# EAGLE design DroneCode_probe-v22 (EAGLE 7.2.0)
CHECK: SAM K; CHECK_DATE: 1/2015; DOC_TITLE_1: MAGIA NEGRA PROBE V2.0; ENGR: JEFF W; ENG_DATE: 1/2015; MFG: JUAN V; MFG_DATE: 1/2015; QA: ALLAN G; QA_DATE: 1/2015; REV: X1; YEAR: 2015
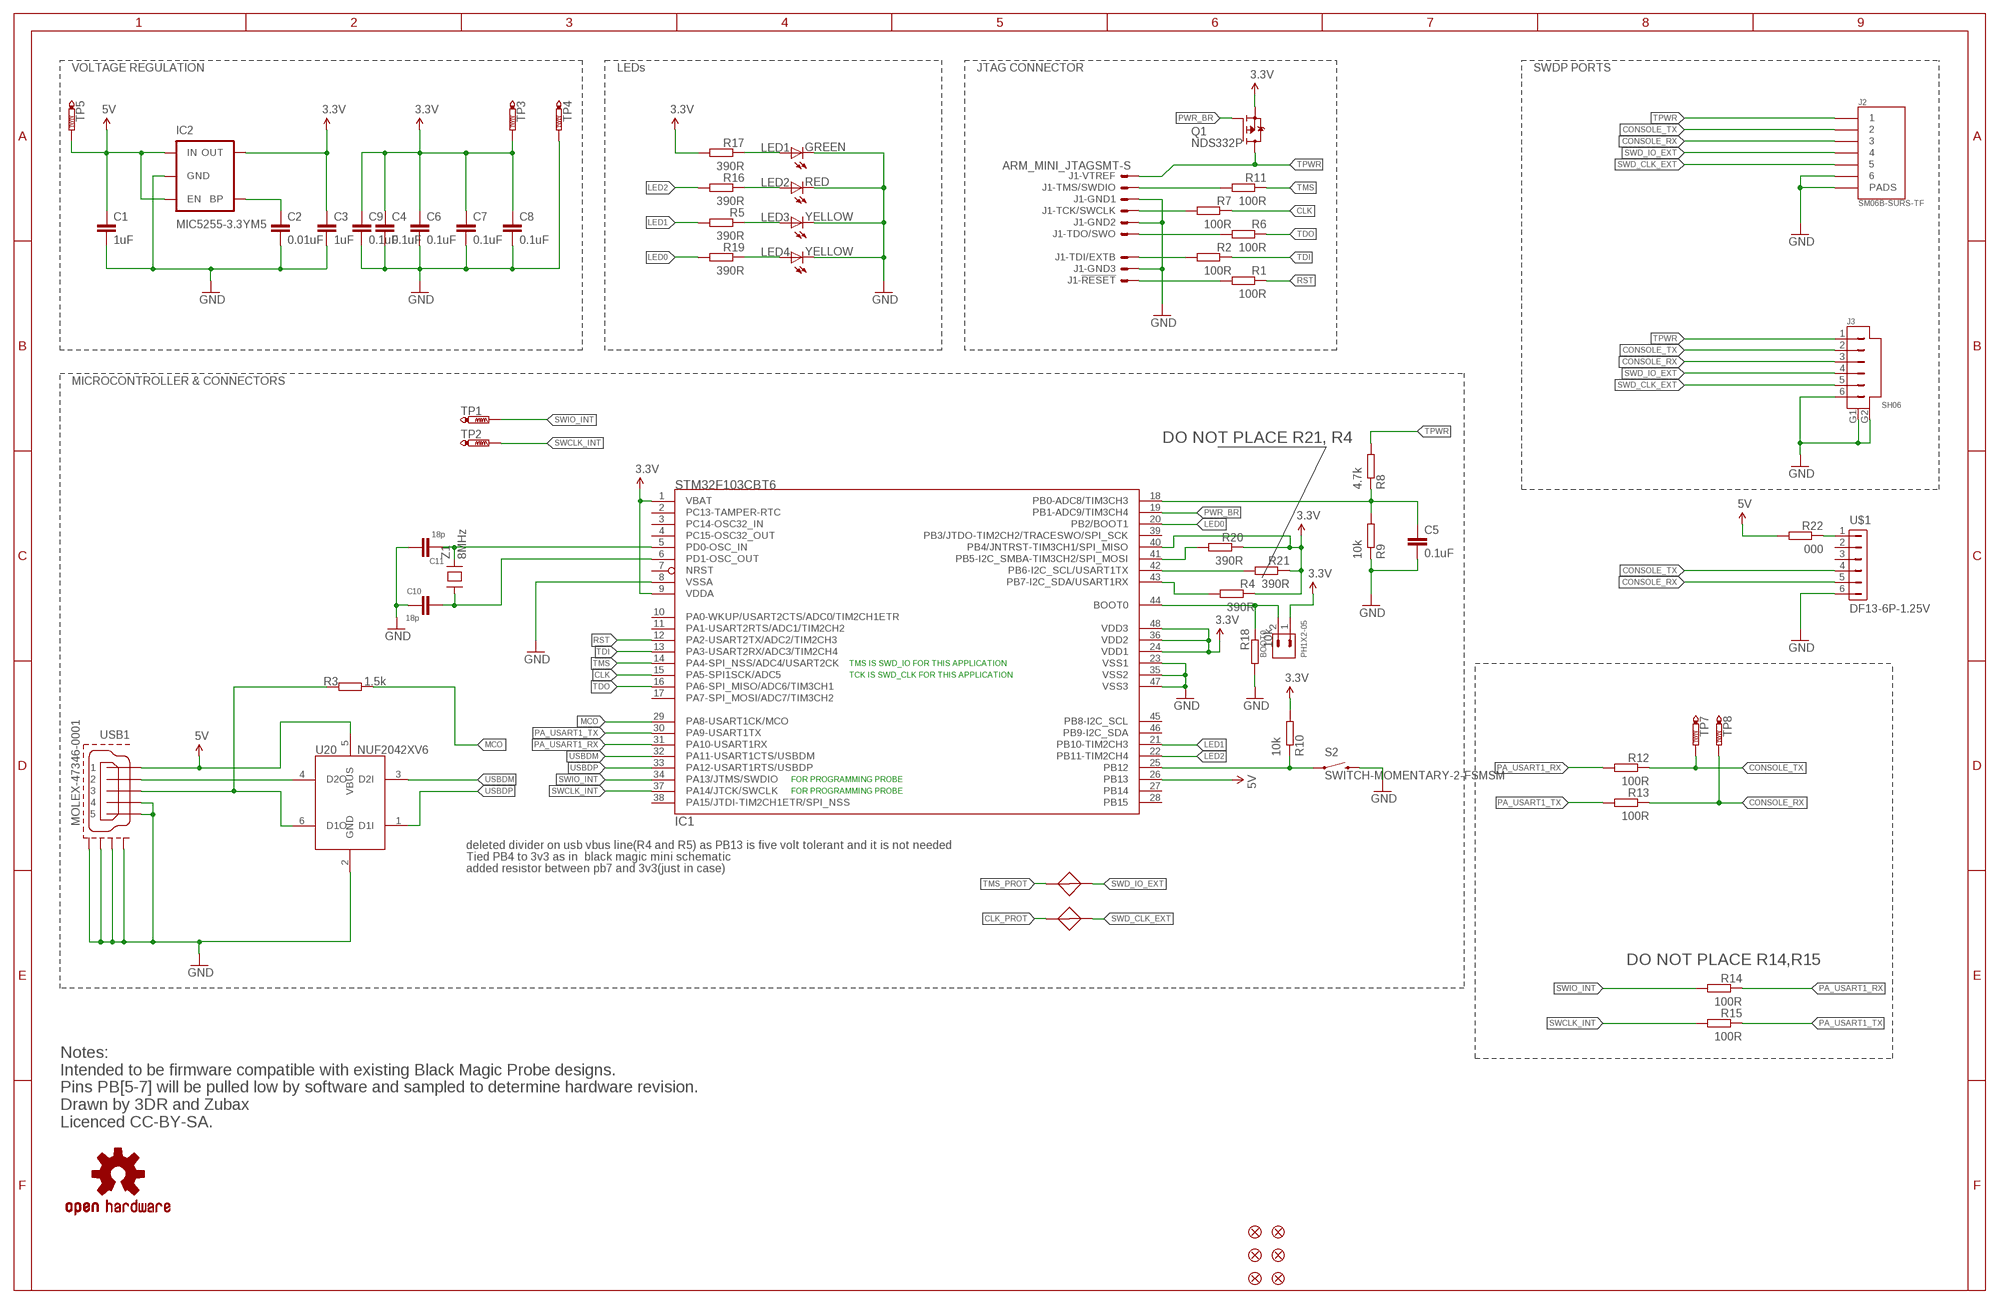
[diagram p0: schematic, sheet 1]

## Parts
BOOT0  PH1X2-05  [PH005-1-2]
C1  1uF  CAPACITOR-0603  [0603-CAP]
C2  0.01uF  CAPACITOR-0402  [0402-CAP]
C3  1uF  CAPACITOR-0603  [0603-CAP]
C4  0.1uF  CAPACITOR-0402  [0402-CAP]
C5  0.1uF  CAPACITOR-0402  [0402-CAP]
C6  0.1uF  CAPACITOR-0402  [0402-CAP]
C7  0.1uF  CAPACITOR-0402  [0402-CAP]
C8  0.1uF  CAPACITOR-0402  [0402-CAP]
C9  0.1uF  CAPACITOR-0402  [0402-CAP]
C10  18p  C0402  [0402]
C11  18p  C0402  [0402]
IC1  STM32F103CBT6  STM32F102CBT6  [LQFP48]
IC2  MIC5255-3.3YM5  V_REG_LDOSMD  [SOT23-5]
J1  ARM_MINI_JTAGSMT-S  [200215-00010T1LF]
J2  SM06B-SURS-TF  [SM02B-SURS-TF]
J3  SH06  [SH06B]
J4  JUNCTION  [JUNCTION]
J5  JUNCTION  [JUNCTION]
JP1  FIDUCIAL1X2  [FIDUCIAL-1X2]
JP2  FIDUCIAL1X2  [FIDUCIAL-1X2]
JP3  FIDUCIAL1X2  [FIDUCIAL-1X2]
JP4  FIDUCIAL1X2  [FIDUCIAL-1X2]
JP5  FIDUCIAL1X2  [FIDUCIAL-1X2]
JP6  FIDUCIAL1X2  [FIDUCIAL-1X2]
LED1  GREEN  LED-0603  [0603-LED]
LED2  RED  LED-0603  [0603-LED]
LED3  YELLOW  LED-0603  [0603-LED]
LED4  YELLOW  LED-0603  [0603-LED]
Q1  NDS332P  [SOT23B-3]
R1  100R  RESISTOR-0402  [0402-RES]
R2  100R  RESISTOR-0402  [0402-RES]
R3  1.5k  RESISTOR-0402  [0402-RES]
R4  390R  RESISTOR-0402  [0402-RES]
R5  390R  RESISTOR-0402  [0402-RES]
R6  100R  RESISTOR-0402  [0402-RES]
R7  100R  RESISTOR-0402  [0402-RES]
R8  4.7k  RESISTOR-0402  [0402-RES]
R9  10k  RESISTOR-0402  [0402-RES]
R10  10k  RESISTOR-0402  [0402-RES]
R11  100R  RESISTOR-0402  [0402-RES]
R12  100R  RESISTOR-0402  [0402-RES]
R13  100R  RESISTOR-0402  [0402-RES]
R14  100R  RESISTOR-0402  [0402-RES]
R15  100R  RESISTOR-0402  [0402-RES]
R16  390R  RESISTOR-0402  [0402-RES]
R17  390R  RESISTOR-0402  [0402-RES]
R18  10k  RESISTOR-0402  [0402-RES]
R19  390R  RESISTOR-0402  [0402-RES]
R20  390R  RESISTOR-0402  [0402-RES]
R21  390R  RESISTOR-0402  [0402-RES]
R22  000  RESISTOR-0402  [0402-RES]
S2  SWITCH-MOMENTARY-2-FSMSM  [FSMSM]
TP1  PTR1B1,27  [B1,27]
TP2  PTR1B1,27  [B1,27]
TP3  PTR1B1,27  [B1,27]
TP4  PTR1B1,27  [B1,27]
TP5  PTR1B1,27  [B1,27]
TP7  PTR1B1,27  [B1,27]
TP8  PTR1B1,27  [B1,27]
U20  NUF2042XV6  [SOT563-6]
U$1  DF13-6P-1.25V  [DF13C-6P-1.25V]
U$5  OSHW-LOGOL  [OSHW-LOGO-L]
USB1  MOLEX-47346-0001  [MOLEX-47346-0001]
Z1  8MHz  CRYSTAL-NX3225GD  [NX3225GD]

## Nets
3.3V: BOOT0.1 C3.P$1 C4.P$1 C6.P$1 C7.P$1 C8.P$1 C9.P$1 IC1.1(VBAT) IC1.9(VDDA) IC1.24(VDD1) IC1.36(VDD2) IC1.40(PB4/JNTRST-TIM3CH1/SPI_MISO) IC1.48(VDD3) IC2.5(OUT) Q1.S R4.P$1 R10.P$2 R17.P$2 R20.P$1 R21.P$1 TP3.TP
5V: C1.P$1 IC1.26(PB13) IC2.1(IN) IC2.3(EN) R22.P$2 TP5.TP U20.5(VBUS) USB1.VBUS
CLK: IC1.15(PA5-SPI1SCK/ADC5) R7.P$1
CLK_PROT: J1.4 J5.P$1 R7.P$2
CONSOLE_RX: J2.3 J3.3 R13.P$1 TP8.TP U$1.5
CONSOLE_TX: J2.2 J3.2 R12.P$1 TP7.TP U$1.4
GND: C1.P$2 C2.P$2 C3.P$2 C4.P$2 C5.P$2 C6.P$2 C7.P$2 C8.P$2 C9.P$2 C10.2 C11.1 IC1.8(VSSA) IC1.23(VSS1) IC1.35(VSS2) IC1.47(VSS3) IC2.2(GND) J1.3 J1.5 J1.9 J2.6 J2.PAD-L(PADS) J2.PAD-R(PADS) J3.6 J3.G1 J3.G2 LED1.C LED2.C LED3.C LED4.C R9.P$1 R18.P$2 S2.P$2 TP4.TP U20.2(GND) U$1.6 USB1.GND USB1.GND1 USB1.GND2 USB1.GND3 USB1.GND4 USB1.ID
LED0: IC1.20(PB2/BOOT1) R19.P$2
LED1: IC1.21(PB10-TIM2CH3) R5.P$2
LED2: IC1.22(PB11-TIM2CH4) R16.P$2
MCO: IC1.29(PA8-USART1CK/MCO) R3.P$2
N$1: U20.4(D2O) USB1.D-
N$2: C2.P$1 IC2.4(BP)
N$3: R3.P$1 U20.6(D1O) USB1.D+
N$4: IC1.43(PB7-I2C_SDA/USART1RX) R4.P$2
N$5: BOOT0.2 IC1.44(BOOT0) R18.P$1
N$6: R22.P$1 U$1.1
N$7: IC1.41(PB5-I2C_SMBA-TIM3CH2/SPI_MOSI) R20.P$2
N$8: IC1.42(PB6-I2C_SCL/USART1TX) R21.P$2
N$11: C5.P$1 IC1.18(PB0-ADC8/TIM3CH3) R8.P$1 R9.P$2
N$12: IC1.25(PB12) R10.P$1 S2.P$1
N$13: LED1.A R17.P$1
N$14: LED2.A R16.P$1
N$15: LED3.A R5.P$1
N$16: LED4.A R19.P$1
N$17: C11.2 IC1.5(PD0-OSC_IN) Z1.2
N$18: C10.1 IC1.6(PD1-OSC_OUT) Z1.1
PA_USART1_RX: IC1.31(PA10-USART1RX) R12.P$2 R14.P$1
PA_USART1_TX: IC1.30(PA9-USART1TX) R13.P$2 R15.P$1
PWR_BR: IC1.19(PB1-ADC9/TIM3CH4) Q1.G
RST: IC1.12(PA2-USART2TX/ADC2/TIM2CH3) R1.P$1
RST_PROT: J1.10 R1.P$2
SWCLK_INT: IC1.37(PA14/JTCK/SWCLK) R15.P$2 TP2.TP
SWD_CLK_EXT: J2.5 J3.5 J5.P$2
SWD_IO_EXT: J2.4 J3.4 J4.P$2
SWIO_INT: IC1.34(PA13/JTMS/SWDIO) R14.P$2 TP1.TP
TDI: IC1.13(PA3-USART2RX/ADC3/TIM2CH4) R2.P$1
TDI_PROT: J1.8 R2.P$2
TDO: IC1.16(PA6-SPI_MISO/ADC6/TIM3CH1) R6.P$1
TDO_PROT: J1.6 R6.P$2
TMS: IC1.14(PA4-SPI_NSS/ADC4/USART2CK) R11.P$1
TMS_PROT: J1.2 J4.P$1 R11.P$2
TPWR: J1.1 J2.1 J3.1 Q1.D R8.P$2
USBDM: IC1.32(PA11-USART1CTS/USBDM) U20.3(D2I)
USBDP: IC1.33(PA12-USART1RTS/USBDP) U20.1(D1I)
Unconnected: IC1.2(PC13-TAMPER-RTC) IC1.3(PC14-OSC32_IN) IC1.4(PC15-OSC32_OUT) IC1.7(NRST) IC1.10(PA0-WKUP/USART2CTS/ADC0/TIM2CH1ETR) IC1.11(PA1-USART2RTS/ADC1/TIM2CH2) IC1.17(PA7-SPI_MOSI/ADC7/TIM3CH2) IC1.27(PB14) IC1.28(PB15) IC1.38(PA15/JTDI-TIM2CH1ETR/SPI_NSS) IC1.39(PB3/JTDO-TIM2CH2/TRACESWO/SPI_SCK) IC1.45(PB8-I2C_SCL) IC1.46(PB9-I2C_SDA) U$1.2 U$1.3

## Notes on the sheet
- VOLTAGE REGULATION | LEDs | JTAG CONNECTOR | SWDP PORTS
- MICROCONTROLLER & CONNECTORS
- DO NOT PLACE R21, R4
- TMS IS SWD_IO FOR THIS APPLICATION
- TCK IS SWD_CLK FOR THIS APPLICATION
- FOR PROGRAMMING PROBE
- FOR PROGRAMMING PROBE
- deleted divider on usb vbus line(R4 and R5) as PB13 is five volt tolerant and it is not needed
- Tied PB4 to 3v3 as in  black magic mini schematic
- added resistor between pb7 and 3v3(just in case)
- DO NOT PLACE R14,R15
- Notes:
  Intended to be firmware compatible with existing Black Magic Probe designs.
  Pins PB[5-7] will be pulled low by software and sampled to determine hardware revision.
  Drawn by 3DR and Zubax
  Licenced CC-BY-SA.

## Library data of the parts
BOOT0 = pel_hdr:PH1X2
C1 C3 = pel_dipol_comp:CAPACITOR; DIGIKEY#: 311-1372-1-ND; PARTNO: CC0603ZRY5V7BB105
C2 = pel_dipol_comp:CAPACITOR; DIGIKEY#: 587-2708-1-ND; PARTNO: EMK105B7103KV-F
C4-C9 = pel_dipol_comp:CAPACITOR; DIGIKEY#: 445-7348-1-ND; PARTNO: C1005X7R1E104K050BB
C10 C11 = pixhawk_esc_1.5_master_lib:C; DIGIKEY#: CL05C180JB5NNNC; MANF#: CL05C180JB5NNNC
IC1 = pel_stm32:STM32F102CBT6: STM32F103 Medium Density 48pins; DIGIKEY#: 497-6288-ND; PARTNO: STM32F103CBT6
IC2 = SparkFun:V_REG_LDO: Voltage Regulator LDO Standard 150mA LDO voltage regulator in SOT-23 layout. Micrel part MIC5205. BP (by-pass) pin is used to lower output noise with 470pF cap.; DIGIKEY#: 576-1290-1-ND; PARTNO: MIC5255-3.3YM5 TR
J1 = pixhawk2:ARM_MINI_JTAG: CONNECTOR wire to board 1.25 mm (.049 inch) pitch header; DIGIKEY#: 609-4054-ND; PARTNO: 20021521-00010T1LF
J2 = con-jst2:SM06B-SURS-TF; DIGIKEY#: SM06B-SURS-TF(LF)(SN)-ND; PARTNO: SM06B-SURS-TF(LF)(SN)
J3 = SH_con:SH06; DIGIKEY#: 455-1806-1-ND; PARTNO: SM06B-SRSS-TB
J4 J5 = junction:JUNCTION
JP1-JP6 = SparkFun:FIDUCIAL: Fiducial Alignment Points Various fiducial points for machine vision alignment.; BOM: EXCLUDE
LED1 = pel_dipol_comp:LED; DIGIKEY#: 754-1121-1-ND; PARTNO: APT1608SGC
LED2 = pel_dipol_comp:LED; DIGIKEY#: 754-1122-1-ND; PARTNO: APT1608SRCPRV
LED3 LED4 = pel_dipol_comp:LED; DIGIKEY#: 754-1125-1-ND; PARTNO: APT1608YC
Q1 = dronecode:NDS332P: MOSFET P-CH 20V 1A SSOT3; DIGIKEY#: NDS332PCT-ND; MANF: Fairchild Semiconductor; MANF#: NDS332P
R1 R2 R6 R7 R11-R13 = pel_dipol_comp:RESISTOR; DIGIKEY#: 311-100LRCT-ND; PARTNO: RC0402FR-07100RL
R3 = pel_dipol_comp:RESISTOR; DIGIKEY#: 311-1.50KLRCT-ND; PARTNO: RC0402FR-071K5L
R4 R21 = pel_dipol_comp:RESISTOR; BOM: EXCLUDE; DIGIKEY#: 541-390JCT-ND; PARTNO: CRCW0402390RJNED
R5 R16 R17 R19 R20 = pel_dipol_comp:RESISTOR; DIGIKEY#: 541-390JCT-ND; PARTNO: CRCW0402390RJNED
R8 = pel_dipol_comp:RESISTOR; DIGIKEY#: P4.70KLCT-ND; PARTNO: ERJ-2RKF4701X
R9 R10 R18 = pel_dipol_comp:RESISTOR; DIGIKEY#: 311-10.0KLRCT-ND; PARTNO: RC0402FR-0710KL
R14 R15 = pel_dipol_comp:RESISTOR; BOM: EXCLUDE; DIGIKEY#: 311-100LRCT-ND; PARTNO: RC0402FR-07100RL
R22 = pel_dipol_comp:RESISTOR; DIGIKEY#: P0.0JCT-ND; PARTNO: ERJ-2GE0R00X
S2 = dronecode:SWITCH-MOMENTARY-2: SWITCH TACTILE SPST-NO 0.05A 24V; DIGIKEY#: 450-1140-ND; MANF: TE Connectivity Alcoswitch Switches; MANF#: FSMSM
TP1-TP5 TP7 TP8 = testpad:PTR1: TEST PIN; BOM: EXCLUDE
U20 = pixhawk2:NUF2042XV6; DIGIKEY#: NUF2042XV6T1GOSCT-ND; PARTNO: NUF2042XV6T1G
U$1 = con-hirose-df13:DF13-6P-1.25: DF13-6P 1.25mm Pitch Miniature Crimping Connector.; DIGIKEY#: H3423-ND; PARTNO: DF13C-6P-1.25V(20)
U$5 = pixhawk2:OSHW-LOGO: Open Source Hardware Logo This logo indicates the piece of hardware it is found on incorporates a OSHW license and/or adheres to the definition of open source hardware found here: http://freedomdefined.org/OSHW
USB1 = pixhawk2:MOLEX-47346-0001: MICRO USB B, BOTTOM MOUNT; DIGIKEY#: WM17141CT-ND; PARTNO: 47346-0001
Z1 = pixhawk_esc_1.5_master_lib:CRYSTAL: SMD CRYSTAL Source: www.ecsxtal.com .. Crystal 3.6864MHz CSM_7X_DU.PDF https://www.kds.info/data/pdf/015E.pdf; DIGIKEY#: 644-1178-1-ND; MANF#: NX3225GD-8MHZ-STD-CRA-3

## Board
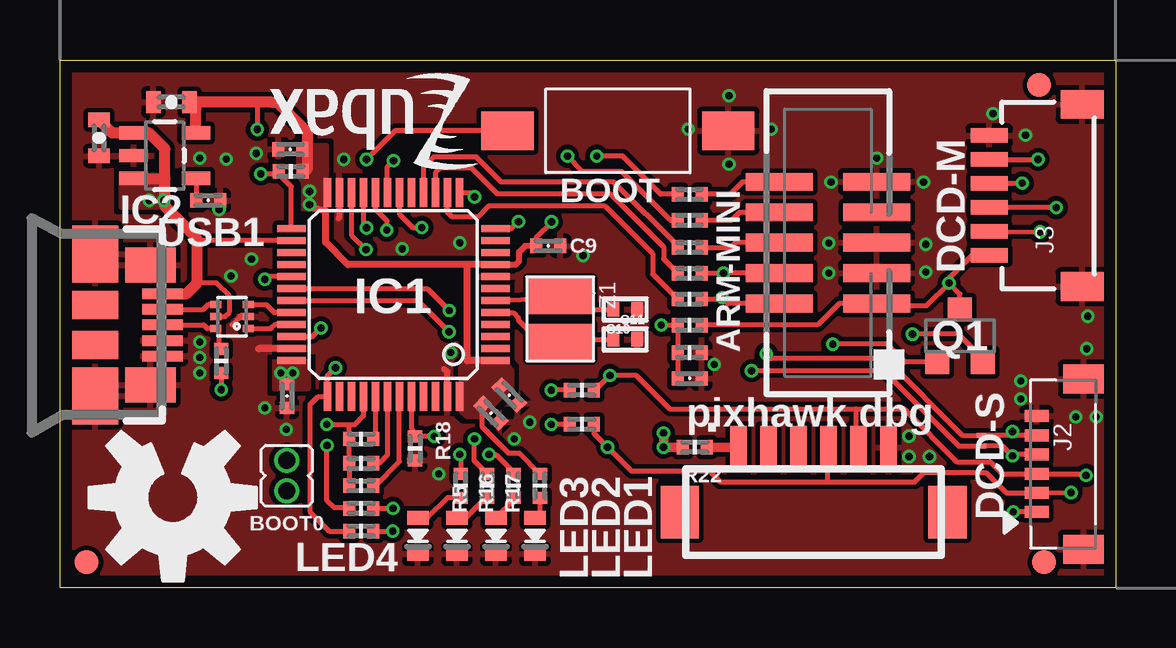
[diagram p1: board, top side]
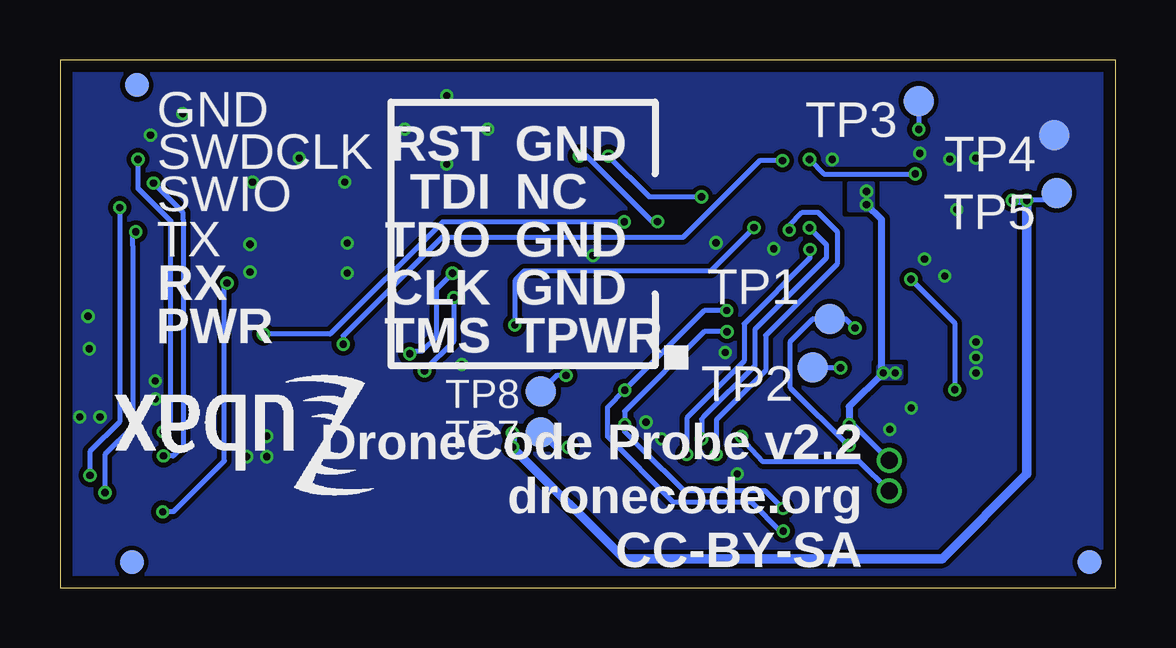
[diagram p2: board, bottom side, seen from below]

Size 44 x 22 mm. Coordinates in mm from the lower left corner, seen from the top.
Outline: 44,22 44,0 0,0 0,22 44,22
Copper layers (1*16): Top 0.035mm / dielectric 0.5mm / Bottom 0.035mm
Design rules "RTK_design_rules *": minimum track width 0.2mm, minimum drill 0.2mm, track to track 0.2mm, track to pad 0.2mm, pad to pad 0.2mm, via to via 0.2mm, smd to smd 0.15mm, copper to edge 0.5mm, drill to drill 0.2mm, minimum pad ring 0.125mm, minimum via ring 0.125mm, stop-mask expansion 1mil, vias tented up to drill 0.31mm, thermal gap 8mil

### Footprints (pad centres in the part's own frame; a part is rotated, then mirrored left to right if it is on the bottom)
PH005-1-2 = drill 0.7 pad 1.016: 1 0,0; 2 1.27,0
0603-CAP = smd 0.6 x 0.9: P$1 -0.75,0; P$2 0.75,0
0402-CAP = smd 0.5 x 0.6: P$1 -0.5,0; P$2 0.5,0
0402 = smd 0.5 x 0.6: 1 -0.5,0; 2 0.5,0
LQFP48 = smd 0.3 x 1.2: 1 -2.75,-4.25; 2 -2.25,-4.25; 3 -1.75,-4.25; 4 -1.25,-4.25; 5 -0.75,-4.25; 6 -0.25,-4.25; 7 0.25,-4.25; 8 0.75,-4.25; 9 1.25,-4.25; 10 1.75,-4.25; 11 2.25,-4.25; 12 2.75,-4.25; 25 2.75,4.25; 26 2.25,4.25; 27 1.75,4.25; 28 1.25,4.25; 29 0.75,4.25; 30 0.25,4.25; 31 -0.25,4.25; 32 -0.75,4.25; 33 -1.25,4.25; 34 -1.75,4.25; 35 -2.25,4.25; 36 -2.75,4.25 | smd 1.2 x 0.3: 13 4.25,-2.75; 14 4.25,-2.25; 15 4.25,-1.75; 16 4.25,-1.25; 17 4.25,-0.75; 18 4.25,-0.25; 19 4.25,0.25; 20 4.25,0.75; 21 4.25,1.25; 22 4.25,1.75; 23 4.25,2.25; 24 4.25,2.75; 37 -4.25,2.75; 38 -4.25,2.25; 39 -4.25,1.75; 40 -4.25,1.25; 41 -4.25,0.75; 42 -4.25,0.25; 43 -4.25,-0.25; 44 -4.25,-0.75; 45 -4.25,-1.25; 46 -4.25,-1.75; 47 -4.25,-2.25; 48 -4.25,-2.75
SOT23-5 = smd 0.55 x 1.2: 1 -0.95,-1.3; 2 0,-1.3; 3 0.95,-1.3; 4 0.95,1.3; 5 -0.95,1.3
200215-00010T1LF = smd 0.737 x 2.794: 1 -2.54,-2.032; 2 -2.54,2.032; 3 -1.27,-2.032; 4 -1.27,2.032; 5 0,-2.032; 6 0,2.032; 7 1.27,-2.032; 8 1.27,2.032; 9 2.54,-2.032; 10 2.54,2.032
SM02B-SURS-TF = smd 0.5 x 1: 1 -2,2.8; 2 -1.2,2.8; 3 -0.4,2.8; 4 0.4,2.8; 5 1.2,2.8; 6 2,2.8 | smd 1.2 x 1.7: PAD-L -3.55,0.85; PAD-R 3.55,0.85
SH06B = smd 0.6 x 1.55: 1 1.9,4.775; 2 2.9,4.775; 3 3.9,4.775; 4 4.9,4.775; 5 5.9,4.775; 6 6.9,4.775 | smd 1.2 x 1.8: G1 0.6,0.9; G2 8.2,0.9
JUNCTION = smd 0.2 x 0.2: P$1 -0.1,0; P$2 0.1,0
FIDUCIAL-1X2 = smd 1 x 1: 1 0,0
0603-LED = smd 0.6 x 0.9: A 0.75,0; C -0.75,0
SOT23B-3 = smd 1 x 1: D 0,1.1; G -0.95,-1.1; S 0.95,-1.1
0402-RES = smd 0.5 x 0.6: P$1 -0.5,0; P$2 0.5,0
FSMSM = smd 2.18 x 1.6: P$1 -4.6,0; P$2 4.6,0
B1,27 = smd 1.27 x 1.27: TP 0,0
SOT563-6 = smd 0.3 x 0.45: 1 -0.5,-0.675; 2 0,-0.675; 3 0.5,-0.675; 4 0.5,0.675; 5 0,0.675; 6 -0.5,0.675
DF13C-6P-1.25V = smd 0.7 x 1.8: 1 -3.125,0.9; 2 -1.875,0.9; 3 -0.625,0.9; 4 0.625,0.9; 5 1.875,0.9; 6 3.125,0.9 | smd 1.6 x 2.2: M$0 5.575,-1.8; M$1 -5.575,-1.8
MOLEX-47346-0001 = smd 1.7 x 0.44: D+ 2.8,0; D- 2.8,0.65; GND 2.8,-1.3; ID 2.8,-0.65; VBUS 2.8,1.3 | smd 1.9 x 2.375: GND1 0,2.95; GND4 0,-2.95 | smd 2.1 x 1.475: GND2 2.3,2.5; GND3 2.3,-2.5 | smd 1.9 x 1.175: GND5 0,-0.838; GND6 0,0.838
NX3225GD = smd 1.5 x 2.7: 1 -0.95,0; 2 0.95,0

### Placement (x,y rotation side)
BOOT0  9.45,5.3 270 top
C1  1.63,18.75 270 top
C2  6.17,16.15 0 top
C3  4.64,20.24 180 top
C4  17.96,7.27 315 top
C5  26.23,8.72 0 top
C6  18.72,8.03 315 top
C7  9.46,7.98 270 top
C8  9.6,18.28 180 top
C9  20.35,14.25 0 top
C10  23.55,11.6 0 top
C11  23.55,10.35 180 top
IC1  13.89,12.22 90 top
IC2  4.36,18.01 270 top
J1  32,14.39 90 top
J2  43.5,5.15 90 top
J3  43.5,11.95 90 top
J4  38.4,5.9 0 top
J5  38.4,6.35 0 top
JP1  1.11,1.06 0 top
JP2  40.8,20.95 0 top
JP3  41,1.06 180 top
JP4  40.8,20.95 180 bottom
JP5  1.11,1.06 180 bottom
JP6  41,1.06 180 bottom
LED1  19.79,2.16 90 top
LED2  18.17,2.16 90 top
LED3  16.54,2.16 90 top
LED4  14.91,2.16 90 top
Q1  37.5,10.5 0 top
R1  26.23,16.4 0 top
R2  26.23,15.32 0 top
R3  6.72,9.45 270 top
R4  12.55,4.25 0 top
R5  17.8,4.25 90 top
R6  26.23,14.19 0 top
R7  26.23,13.11 0 top
R8  26.23,10.95 0 top
R9  26.23,9.8 180 top
R10  9.62,17.35 0 top
R11  26.23,12.03 0 top
R12  21.75,6.81 180 top
R13  21.75,8.23 180 top
R14  12.55,3.3 180 top
R15  12.55,2.35 180 top
R16  18.9,4.25 90 top
R17  20,4.25 90 top
R18  14.8,5.8 270 top
R19  16.7,4.25 90 top
R20  12.55,6.2 0 top
R21  12.55,5.19 0 top
R22  26.45,5.85 180 top
S2  23.25,19.05 0 top
TP1  11.92,11.21 90 bottom
TP2  12.62,9.17 90 bottom
TP3  8.22,20.3 180 bottom
TP4  2.57,18.86 90 bottom
TP5  2.47,16.45 90 bottom
TP7  23.96,6.48 90 bottom
TP8  23.96,8.18 90 bottom
U20  7.17,11.3 90 top
U$1  31.4,4.95 0 top
U$5  4.7,3.76 180 top
U$7  [ZUBAX_LOGO_4X8]  17.45,21.6 180 top
U$8  [ZUBAX_LOGO_5X10]  30.85,9.05 180 bottom
USB1  1.47,10.95 0 top
Z1  20.85,11.2 270 top

### Tracks (layer width: path | path; a pad name or v marks a point on that pad's centre or on a via)
3.3V  (via drill 0.3)
  Top 0.2: 17.57,7.62 C4.P$1 | 8.78,20.25 8.22,20.25 v8.22,19.1 | R21.P$1 R4.P$1 | IC1.40 12.64,7.15 | C9.P$1 19.85,14.62 v20.48,15.25 | R17.P$2 19.15,5.6 18.7,5.6 17.6,6.7 C4.P$1 | 17.6,7.46 C4.P$1 | Q1.S 38.45,9.55 37.43,10.57 v35.52,10.57
  Top 0.203: R21.P$1 R20.P$1 12.05,6.8 | v11.12,6.8 12.05,6.8 | 12.05,6.8 12.3,6.8 12.64,7.15
  Top 0.254: C9.P$1 19.38,14.25 19.13,14 19.13,13.62 18.98,13.47 IC1.9
  Top 0.3: IC1.9 16.97,13.47 | 16.97,13.47 12,13.47 11.07,14.4 11.07,15.71 10.39,15.84 | IC1.1 16.97,9.47 16.97,13.47
  Top 0.45: 10.14,17.33 10.3,17.43 10.3,19 9.05,20.25 8.78,20.25 C3.P$1 5.66,19.97 IC2.5
  Bottom 0.2: v20.48,15.25 28.06,15.25 32.74,10.57 v35.52,10.57 | TP3.TP v8.22,19.1
  Bottom 0.203: BOOT0.1 10.95,6.8 v11.12,6.8
  Bottom 0.3: v11.12,6.8 11.12,7.55 v9.7,8.96 9.76,9.01 9.77,15.35 v10.39,15.98
  other vias: 9.2,8.95 10.39,16.53
  pour Top (isolate 0.3, rank 5, no thermals): 18.56,9.4 16.94,9.43 16.69,9.17 16.69,7.39 16.94,7.14 17.58,7.14 18.85,8.41 18.85,9.05
  pour Top (isolate 0.305, rank 5, no thermals): 11.1,18.44 11.1,15.78 9.96,15.78 9.96,18.44
  pour Top (isolate 0.3, rank 5, no thermals): 10.34,8.28 8.94,8.28 8.94,9.55 10.34,9.55
  pour Bottom: 10.15,15.75 11.1,15.75 11.1,16.85 10.15,16.85
  pour Bottom (no thermals): 9.9,8.75 8.95,8.75 8.95,9.2 9.9,9.2
5V  (via drill 0.3)
  Top 0.2: U20.5 6.86,11.3 7.07,11.5 7.07,12.15 6.52,12.7 5.72,12.7 | IC1.26 5.8,14.47 5.72,14.55 | 4.27,16.45 4.37,16.35
  Top 0.4: R22.P$2 v25.15,5.85 v25.15,6.45
  Top 0.45: USB1.VBUS 5.27,12.25 5.72,12.7 5.72,14.55 4.37,15.9 4.37,16.35 4.37,17.05 | 4.37,17.05 4.37,18.3 3.71,18.96 IC2.1 3.05,18.95 2.18,18.95 C1.P$1 | IC2.3 4.37,17.05
  Bottom 0.2: TP5.TP 2.77,16.15 v3.72,16.15
  Bottom 0.4: v4.32,16.15 v3.72,16.15 3.72,4.73 7.25,1.2 20.5,1.2 v25.15,5.85 v25.15,6.45
  pour Top (no thermals): 2.7,17.2 4.5,17.2 4.5,15.85 2.55,15.85 2.55,17.2 2.65,17.2
CLK
  Top 0.2: IC1.15 15.64,17.3 15.85,17.5 17.15,17.5 18.24,16.41 22.94,16.41 25.15,14.21 25.15,13.7 R7.P$1
CLK_PROT  (via drill 0.3)
  Top 0.2: R7.P$2 v27.64,13.11 v27.65,13.12 J1.4 | 34.4,9.55 37.6,6.35 J5.P$1
  Top 0.203: 34.4,9.55 29.62,9.55 v29.42,9.76
  Bottom 0.203: v29.42,9.76 29.32,9.86 28.91,9.86 28.3,10.47 28.3,12.45 v27.64,13.11
CONSOLE_RX  (via drill 0.3)
  Top 0.2: 33.17,7.45 25.4,7.45 24.02,8.84 v22.92,8.84 | 33.17,7.45 35.17,7.45 37.37,5.25 38.76,5.25 39.26,4.75 J2.3 42.67,4.75 v42.75,4.68 | 33.18,5.93 33.17,5.94 33.17,7.45
  Top 0.203: v41.51,15.85 38.88,15.85 J3.3 | 33.18,5.93 U$1.5 | v22.92,8.84 22.31,8.23 R13.P$1
  Bottom 0.2: v41.51,15.85 41.51,6.91 42.75,5.68 v42.75,4.68
  Bottom 0.203: v22.92,8.84 23.3,8.84 TP8.TP
CONSOLE_TX  (via drill 0.3)
  Top 0.2: 31.97,4.4 27.52,4.4 27.07,4.85 23.81,4.85 v22.81,5.85 22.25,6.42 R12.P$1 | 31.97,4.4 35.62,4.4 36.02,4.8 38.57,4.8 39.42,3.95 J2.2 | U$1.4 31.97,5.87 31.97,4.4 | 38.9,14.85 v40.84,14.84
  Top 0.203: 38.9,14.85 J3.2 | J2.2 40.91,3.96 v42.12,3.97
  Bottom 0.2: 40.97,14.26 40.97,6.7 42.12,5.55 v42.12,3.97
  Bottom 0.203: TP7.TP 23.33,5.85 v22.81,5.85 | 40.97,14.26 40.97,14.71 v40.84,14.84
GND  (via drill 0.3)
  Top 0.2: 7.51,11.3 7.17,10.95
  Top 0.254: IC1.47 16.14,9.01 16,9.12 | IC1.23 11.64,15.43 11.61,15.4
  Top 0.3: IC1.35 8.28,9.97 8.27,9.95 | U20.2 7.51,11.3
  other vias: 34.03,17.91 16.28,9.8 21.79,13.85 27.26,9.3 11.82,17.86 8.17,18.11 16.66,14.38 14.26,14.13 5.83,8.95 5.83,9.6 5.83,10.25 7.13,13 7.98,13.7 8.53,7.5 9.43,6.6 15.78,4.75 18.93,6.2 19.58,6.9 35.98,16.91 32.13,16.91 36.08,13.16 36.08,14.31 32.03,13.11 32.03,14.36 35.38,6.31 35.38,5.46 36.23,5.46 40.03,7.86 40.03,8.61 42.78,9.96 42.83,11.31 38.88,19.76 40.23,18.86 29.63,19.11 27.88,17.66 27.88,20.51 26.18,19.11 5.83,17.91 6.93,17.86 42.33,7.11 43.18,7.11 6.63,15.76
  pour Top (rank 6): 44.23,-0.26 -0.17,-0.26 -0.17,22.32 44.23,22.32
  pour Bottom (rank 6, no thermals): 44.23,-0.26 -0.17,-0.26 -0.17,22.27 44.23,22.27
LED0  (via drill 0.3)
  Top 0.2: IC1.20 13.14,15.78 13.62,15.3 v13.62,14.9 | v16.65,5.55 16.7,5.51 R19.P$2
  Bottom 0.2: v13.62,14.9 13.62,15.1 13.07,15.65 12.42,15.65 11.62,14.85 11.62,13.5 14.6,10.52 14.6,9.05 16.55,7.1
  Bottom 0.203: 16.55,7.1 16.65,7 16.65,6.1 v16.65,5.55
LED1  (via drill 0.3)
  Top 0.2: IC1.21 12.64,15.13 v12.77,15 | 17.25,6.17 17.25,5.3 R5.P$2
  Top 0.203: 17.25,6.17 17.25,6.18 v17.27,6.2
  Bottom 0.2: v12.77,15 12.07,14.3 12.07,13.75 15.05,10.77 15.05,9.25 17.17,7.13
  Bottom 0.203: 17.17,7.13 17.27,7.03 v17.27,6.2
LED2  (via drill 0.3)
  Top 0.2: IC1.22 12.14,14.71 v12.75,14.1 | v17.88,5.55 18.15,5.55 18.9,4.8 R16.P$2
  Bottom 0.2: v12.75,14.1 12.75,13.75 15.5,11 15.5,9.45 17.88,7.07 v17.88,5.55
MCO  (via drill 0.3)
  Top 0.2: IC1.29 8.65,12.97 v8.54,12.86
  Top 0.203: R3.P$2 v6.72,8.25
  Bottom 0.203: v8.54,12.86 6.72,11.04 v6.72,8.25
N$1
  Top 0.2: U20.4 6.17,11.8 5.97,11.6 USB1.D-
N$2
  Top 0.2: IC2.4 5.67,16.79 C2.P$1
N$3
  Top 0.2: USB1.D+ 5.98,10.95 6.13,10.8 U20.6 6.62,10.8 6.62,10.16 6.74,9.98
N$4
  Top 0.2: R4.P$2 13.15,4.25 14.14,5.25 IC1.43
N$5  (via drill 0.3)
  Top 0.2: IC1.44 14.64,6.65 14.85,6.35
  Top 0.203: v15.6,6.3 R18.P$1
  Bottom 0.203: BOOT0.2 10.67,5.25 14.7,5.25 15.63,6.27
N$6
  Top 0.4: U$1.1 R22.P$1
N$7
  Top 0.203: IC1.41 13.14,6.3 R20.P$2
N$8
  Top 0.203: IC1.42 13.64,5.53 13.3,5.18 R21.P$2
N$11  (via drill 0.3)
  Top 0.2: C5.P$1 R9.P$2 R8.P$1 v25.05,10.95 | IC1.18 14.14,15.58 14.71,15.01 v15.08,15.01
  Bottom 0.2: v15.08,15.01 16.89,13.2 24.65,13.2 25.05,12.8 v25.05,10.95
N$12  (via drill 0.3)
  Top 0.2: IC1.25 9.64,16.73 9.12,17.25 R10.P$1 9.02,17.25 v8.37,17.25 | S2.P$1 13.97,19.05 v12.77,17.85
  Bottom 0.2: v12.77,17.85 12.17,17.25 v8.37,17.25
N$13
  Top 0.2: R17.P$1 20,3.11 LED1.A
  Top 0.203: LED1.A 19.79,3.03
N$14
  Top 0.2: R16.P$1 18.9,3.64 LED2.A
N$15
  Top 0.2: R5.P$1 17.75,3.75 16.9,2.91 LED3.A
N$16
  Top 0.2: R19.P$1 16.15,3.75 15.3,2.91 LED4.A
N$17
  Top 0.2: IC1.5 18.88,11.47 19.1,11.25 19.1,11.15 19.8,10.45 19.9,10.45 20.85,10.35 | 20.9,10.25 20.9,10.7 21.3,10.35 C11.2
N$18
  Top 0.2: IC1.6 20.26,12.06 20.85,12.06 | Z1.1 21.4,11.6 C10.1
PA_USART1_RX  (via drill 0.3)
  Top 0.2: 14.9,11.97 v16.2,10.67 | R14.P$1 v13.87,3.3
  Top 0.203: IC1.31 14.9,11.97 | R12.P$2 v20.47,6.81
  Bottom 0.2: v16.2,10.67 17.15,10.67 | 19.72,5.75 18.02,4.05 14.62,4.05 v13.87,3.3
  Bottom 0.203: 19.72,5.75 20.47,6.51 v20.47,6.81 20.47,7.35 17.15,10.67
PA_USART1_TX  (via drill 0.3)
  Top 0.2: IC1.30 15.3,12.47 v16.22,11.55 | R15.P$1 v13.87,2.35
  Top 0.203: R13.P$2 v20.47,8.23
  Bottom 0.2: v16.22,11.55 17.15,11.55 v20.47,8.23 | 21.18,6.3 18.44,3.56 15.18,3.56 13.98,2.35 v13.87,2.35
  Bottom 0.203: 21.18,6.3 21.18,7.52 v20.47,8.23
PWR_BR  (via drill 0.3)
  Top 0.2: Q1.G 35.2,9.4 34.45,10.15 v32.2,10.15 | IC1.19 13.64,17.55 v13.9,17.8
  Bottom 0.2: v13.9,17.8 14.85,17.8 18.05,14.6 28.1,14.6 32.2,10.5 v32.2,10.15
RST  (via drill 0.3)
  Top 0.2: R1.P$1 25.04,16.4 23.44,17.99 v22.36,17.99 | IC1.12 18.8,14.97 v19.1,15.27
  Bottom 0.2: v22.36,17.99 22.35,18 22.05,18 19.31,15.27 v19.1,15.27
RST_PROT
  Top 0.2: J1.10 28.44,16.93 27.92,16.41 26.74,16.41 R1.P$2
SWCLK_INT  (via drill 0.3)
  Top 0.2: IC1.37 11.14,8.84 v11.48,9.17 | R15.P$2 11.23,2.35 10.41,3.17
  Top 0.203: 10.41,3.17 10.41,7.62 10.76,7.97 IC1.37
  Bottom 0.2: TP2.TP v11.48,9.17
SWD_CLK_EXT  (via drill 0.3)
  Top 0.2: J2.5 39.84,6.35 v39.68,6.51 39.53,6.35 J5.P$2
  Top 0.203: J3.5 v40.75,17.85
  Bottom 0.203: v39.68,6.51 39.68,6.52 39.38,6.83 39.38,15.29 40.75,16.66 v40.75,17.85
SWD_IO_EXT  (via drill 0.3)
  Top 0.2: J2.4 39.75,5.55 v39.68,5.49 39.27,5.9 J4.P$2 | 38.86,16.86 v40.1,16.87
  Top 0.203: 38.86,16.86 J3.4
  Bottom 0.2: 38.87,15.35 38.87,5.9 39.28,5.49 v39.68,5.49
  Bottom 0.203: 38.87,15.35 38.87,15.64 v40.1,16.87
SWIO_INT  (via drill 0.3)
  Top 0.2: IC1.34 10.52,10.47 v10.87,10.82 | R14.P$2 12.02,3.33
  Top 0.203: 12.02,3.33 11.42,3.33 11.12,3.63 v11.12,5.93
  Bottom 0.2: 13.56,10.26 12.62,11.21 TP1.TP 11.25,11.21 v10.87,10.82
  Bottom 0.203: 13.56,10.26 13.56,8.34 11.15,5.93 v11.12,5.93
TDI  (via drill 0.3)
  Top 0.2: v21.15,17.99 21.79,17.35 23.4,17.35 25.43,15.32 R2.P$1 | IC1.13 17.09,16.47 v17.27,16.3
  Bottom 0.2: v21.15,17.99 19.45,16.3 v17.27,16.3
TDI_PROT
  Top 0.2: R2.P$2 27.99,15.32 28.32,15.65 J1.8
TDO
  Top 0.2: IC1.16 15.14,17.53 15.57,17.95 17.35,17.95 18.38,16.92 23.07,16.92 25.73,14.26 R6.P$1
TDO_PROT
  Top 0.2: R6.P$2 27.95,14.19 28.17,14.4 29.94,14.4 J1.6
TMS
  Top 0.2: IC1.14 16.14,15.66 16.35,15.45 17.4,15.45 17.85,15.9 22.72,15.9 24.7,13.92 24.7,13.07 R11.P$1
TMS_PROT  (via drill 0.3)
  Top 0.2: R11.P$2 27.53,12.03 v27.59,12.09 27.84,11.85 J1.2 | 34.3,9.05 37.44,5.9 J4.P$1
  Top 0.203: v28.81,9.05 34.3,9.05
  Bottom 0.203: v27.59,12.09 27.59,10.26 v28.81,9.05
TPWR  (via drill 0.3)
  Top 0.2: J1.1 32.46,11.85 31.57,10.95 R8.P$2 | Q1.D 37.5,12.25 v37.04,12.7
  Top 0.203: J3.1 38,13.87 37.04,12.91 v37.04,12.7 36.1,11.76 34.11,11.76 J1.1 | J2.1 40.89,3.16 v39.72,3.16
  Bottom 0.203: v37.04,12.7 37.14,12.6 37.14,5.29 39.27,3.16 v39.72,3.16
USBDM
  Top 0.2: IC1.32 8.93,11.47 8.6,11.8 U20.3
USBDP
  Top 0.2: IC1.33 8.96,10.97 8.79,10.8 U20.1

### Text on the board
tPlace: DCD-M | BOOT | ARM-MINI | DCD-S | pixhawk dbg
bPlace: GND | SWDCLK | SWIO | TX | RX | PWR | DroneCode Probe v2.2 / dronecode.org / CC-BY-SA
bNames: GND | RST | NC | TDI | GND | TDO | GND | CLK | TPWR | TMS